# Altium schematic sheet Out_current_sensor_UVW.SchDoc
size 508 x 508 mm
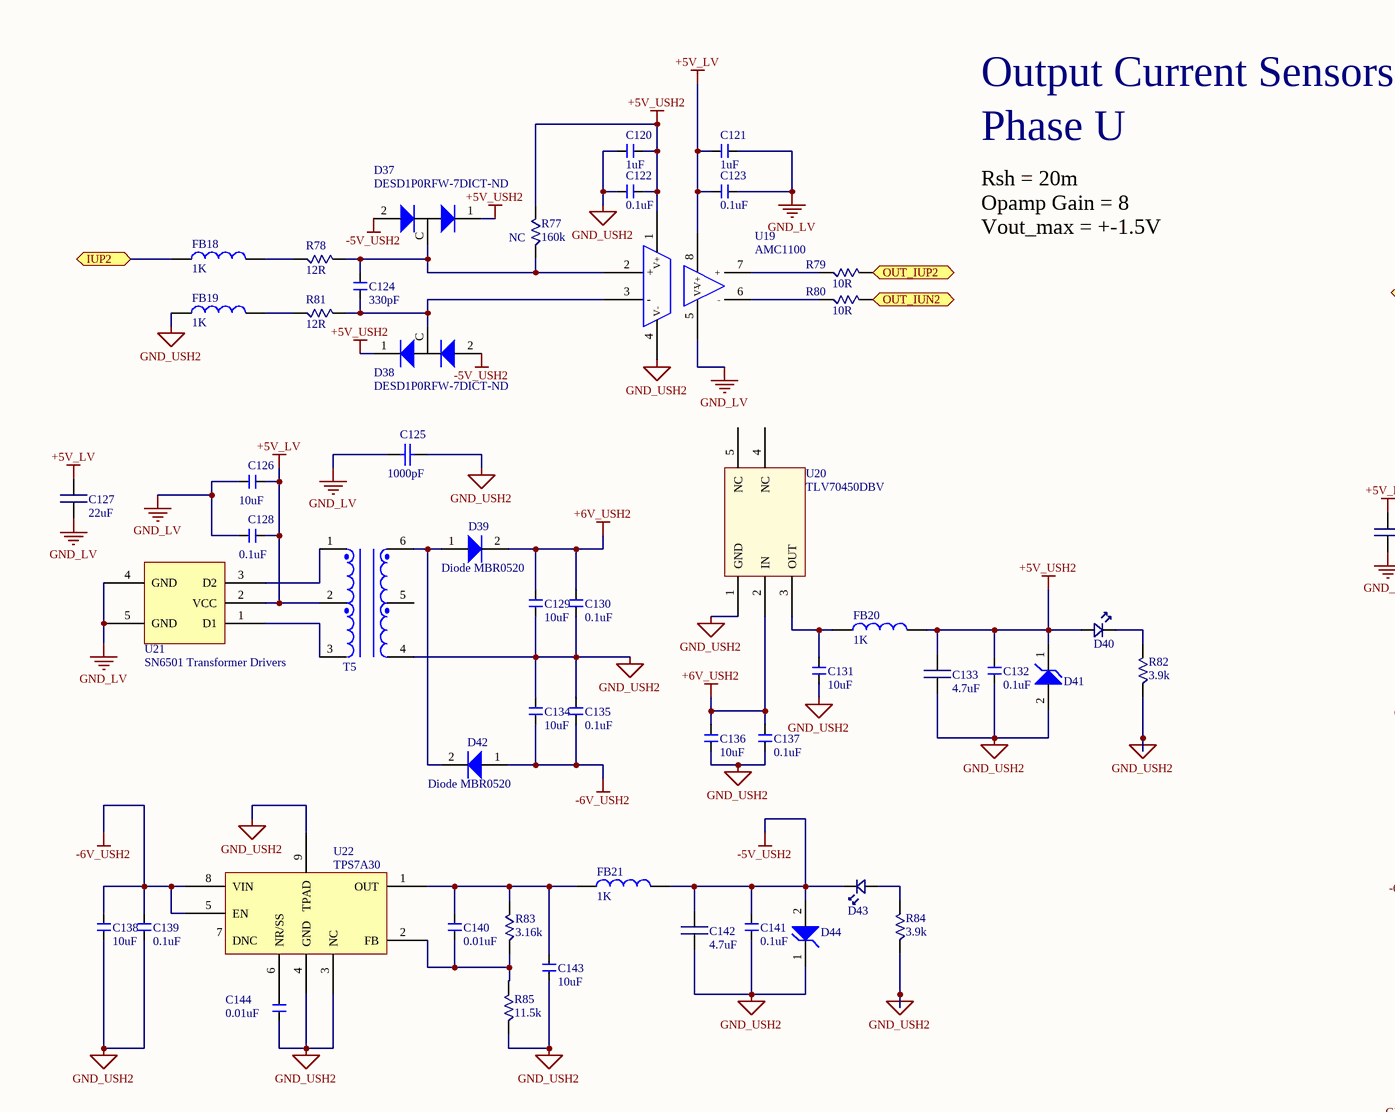
[diagram p0: Out_current_sensor_UVW.SchDoc, top left]
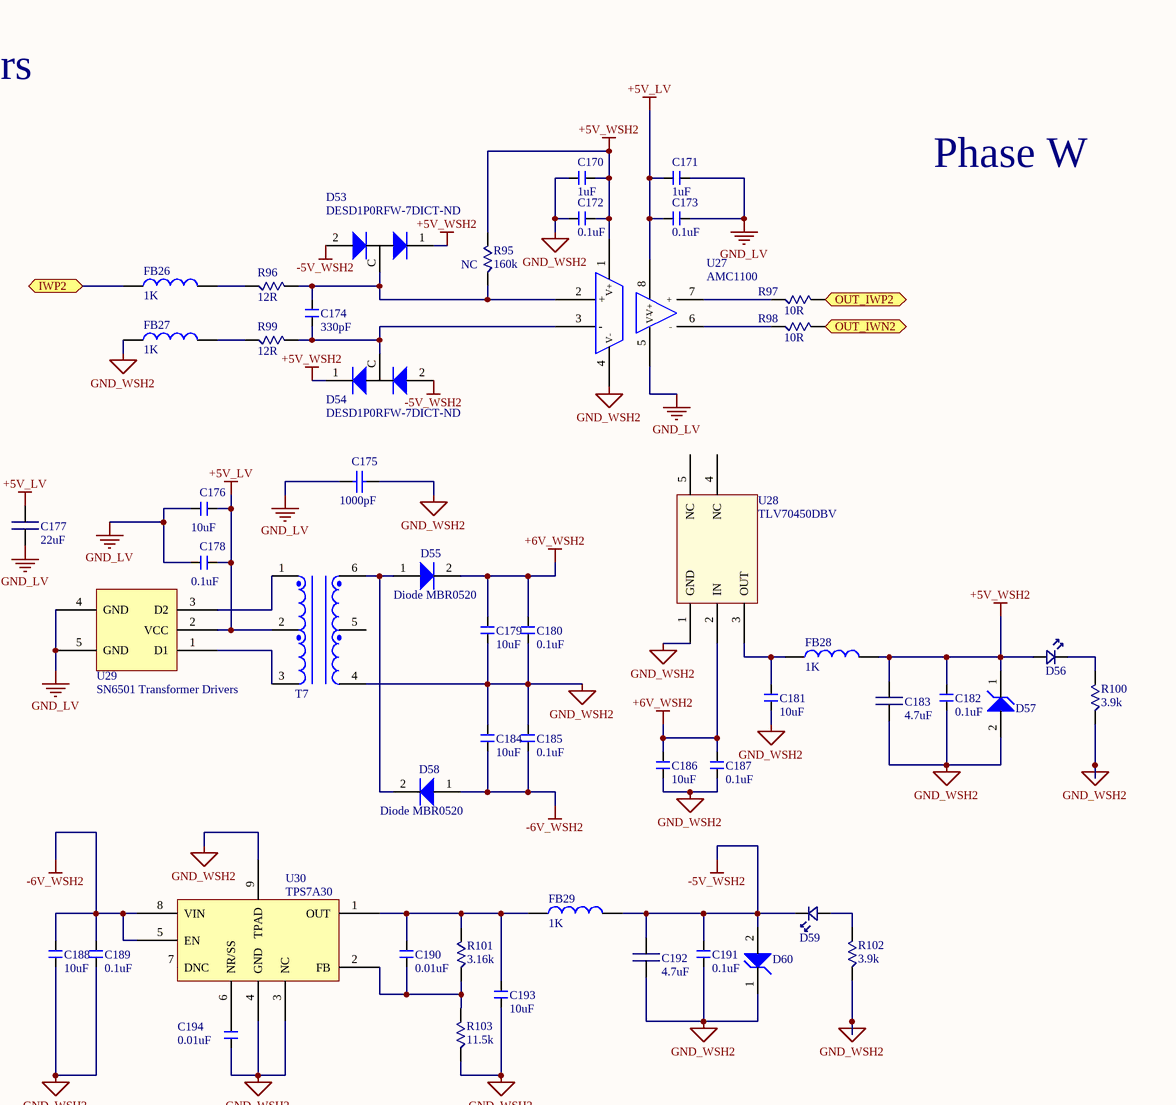
[diagram p1: Out_current_sensor_UVW.SchDoc, top right]
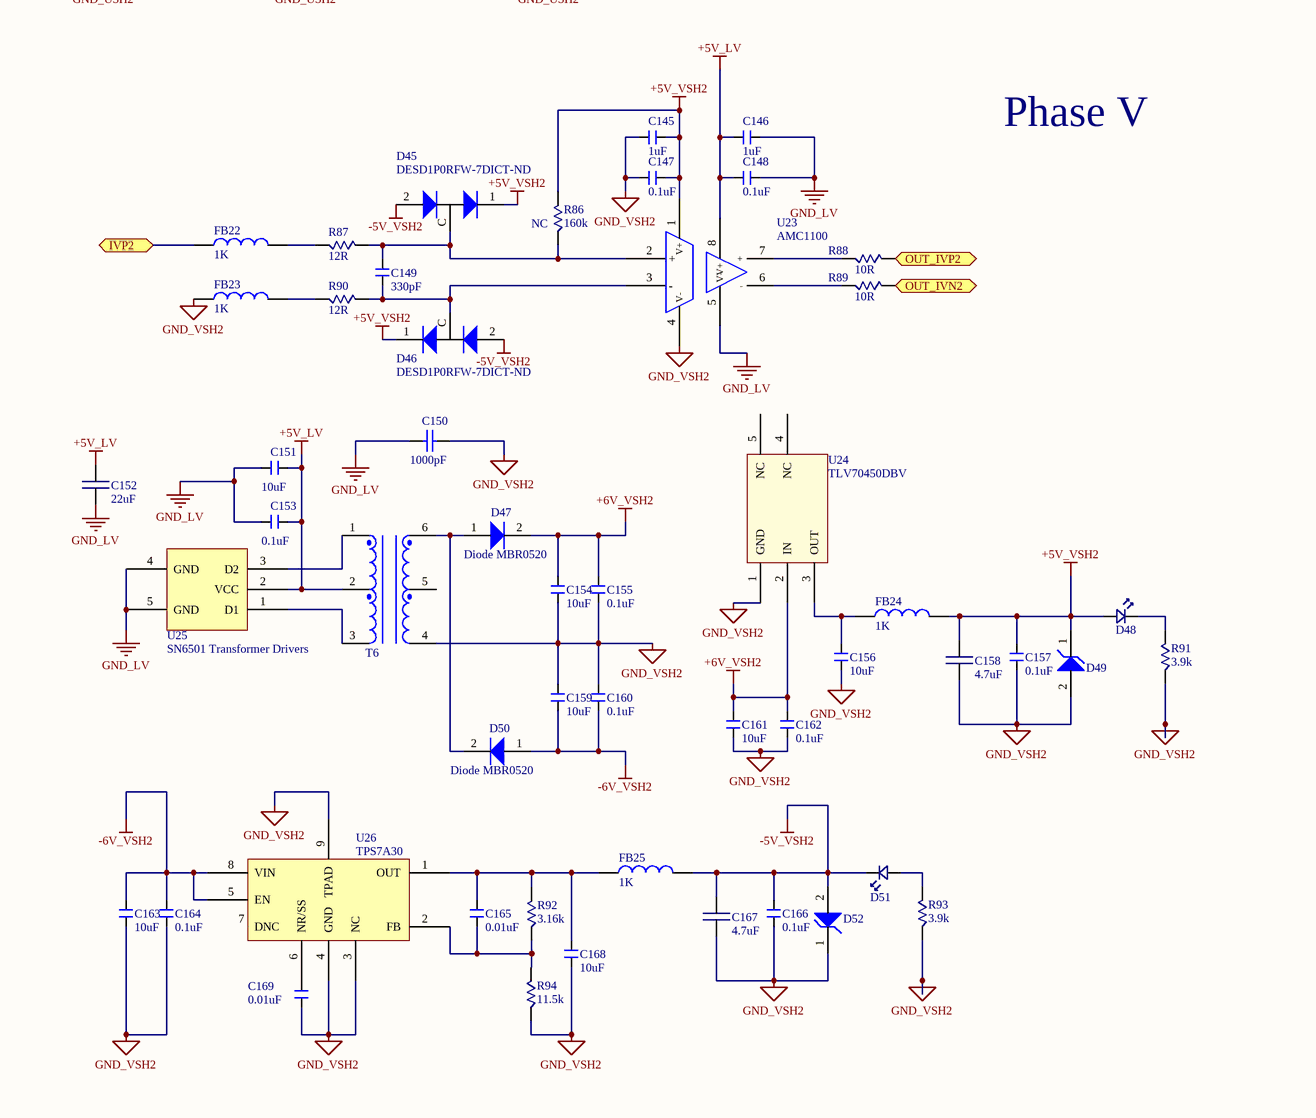
[diagram p2: Out_current_sensor_UVW.SchDoc, bottom left]

## Parts
C120  value 1uF  [0603 (1608 Metric)]  (hidden comment: Cap 0603_new)
C121  value 1uF  [0603 (1608 Metric)]  (hidden comment: Cap 0603_new)
C122  value 0.1uF  [0603 (1608 Metric)]  (hidden comment: Cap 0603_new)
C123  value 0.1uF  [0603 (1608 Metric)]  (hidden comment: Cap 0603_new)
C124  value 330pF  [0603 (1608 Metric)]  (hidden comment: Cap 0603_new)
C125  value 1000pF  [RAD-0.3]  (hidden comment: Cap TH)
C126  value 10uF  [0603 (1608 Metric)]  (hidden comment: Cap 0603_new)
C127  value 22uF  [0805 (2012 metric)]  (hidden comment: Cap 0805)
C128  value 0.1uF  [0603 (1608 Metric)]  (hidden comment: Cap 0603_new)
C129  value 10uF  [0603 (1608 Metric)]  (hidden comment: Cap 0603_new)
C130  value 0.1uF  [0603 (1608 Metric)]  (hidden comment: Cap 0603_new)
C131  value 10uF  [0603 (1608 Metric)]  (hidden comment: Cap 0603_new)
C132  value 0.1uF  [0603 (1608 Metric)]  (hidden comment: Cap 0603_new)
C133  value 4.7uF  [0805 (2012 metric)]  (hidden comment: Cap 0805)
C134  value 10uF  [0603 (1608 Metric)]  (hidden comment: Cap 0603_new)
C135  value 0.1uF  [0603 (1608 Metric)]  (hidden comment: Cap 0603_new)
C136  value 10uF  [0603 (1608 Metric)]  (hidden comment: Cap 0603_new)
C137  value 0.1uF  [0603 (1608 Metric)]  (hidden comment: Cap 0603_new)
C138  value 10uF  [0603 (1608 Metric)]  (hidden comment: Cap 0603_new)
C139  value 0.1uF  [0603 (1608 Metric)]  (hidden comment: Cap 0603_new)
C140  value 0.01uF  [0603 (1608 Metric)]  (hidden comment: Cap 0603_new)
C141  value 0.1uF  [0603 (1608 Metric)]  (hidden comment: Cap 0603_new)
C142  value 4.7uF  [0805 (2012 metric)]  (hidden comment: Cap 0805)
C143  value 10uF  [0603 (1608 Metric)]  (hidden comment: Cap 0603_new)
C144  value 0.01uF  [0603 (1608 Metric)]  (hidden comment: Cap 0603_new)
C145  value 1uF  [0603 (1608 Metric)]  (hidden comment: Cap 0603_new)
C146  value 1uF  [0603 (1608 Metric)]  (hidden comment: Cap 0603_new)
C147  value 0.1uF  [0603 (1608 Metric)]  (hidden comment: Cap 0603_new)
C148  value 0.1uF  [0603 (1608 Metric)]  (hidden comment: Cap 0603_new)
C149  value 330pF  [0603 (1608 Metric)]  (hidden comment: Cap 0603_new)
C150  value 1000pF  [RAD-0.3]  (hidden comment: Cap TH)
C151  value 10uF  [0603 (1608 Metric)]  (hidden comment: Cap 0603_new)
C152  value 22uF  [0805 (2012 metric)]  (hidden comment: Cap 0805)
C153  value 0.1uF  [0603 (1608 Metric)]  (hidden comment: Cap 0603_new)
C154  value 10uF  [0603 (1608 Metric)]  (hidden comment: Cap 0603_new)
C155  value 0.1uF  [0603 (1608 Metric)]  (hidden comment: Cap 0603_new)
C156  value 10uF  [0603 (1608 Metric)]  (hidden comment: Cap 0603_new)
C157  value 0.1uF  [0603 (1608 Metric)]  (hidden comment: Cap 0603_new)
C158  value 4.7uF  [0805 (2012 metric)]  (hidden comment: Cap 0805)
C159  value 10uF  [0603 (1608 Metric)]  (hidden comment: Cap 0603_new)
C160  value 0.1uF  [0603 (1608 Metric)]  (hidden comment: Cap 0603_new)
C161  value 10uF  [0603 (1608 Metric)]  (hidden comment: Cap 0603_new)
C162  value 0.1uF  [0603 (1608 Metric)]  (hidden comment: Cap 0603_new)
C163  value 10uF  [0603 (1608 Metric)]  (hidden comment: Cap 0603_new)
C164  value 0.1uF  [0603 (1608 Metric)]  (hidden comment: Cap 0603_new)
C165  value 0.01uF  [0603 (1608 Metric)]  (hidden comment: Cap 0603_new)
C166  value 0.1uF  [0603 (1608 Metric)]  (hidden comment: Cap 0603_new)
C167  value 4.7uF  [0805 (2012 metric)]  (hidden comment: Cap 0805)
C168  value 10uF  [0603 (1608 Metric)]  (hidden comment: Cap 0603_new)
C169  value 0.01uF  [0603 (1608 Metric)]  (hidden comment: Cap 0603_new)
C170  value 1uF  [0603 (1608 Metric)]  (hidden comment: Cap 0603_new)
C171  value 1uF  [0603 (1608 Metric)]  (hidden comment: Cap 0603_new)
C172  value 0.1uF  [0603 (1608 Metric)]  (hidden comment: Cap 0603_new)
C173  value 0.1uF  [0603 (1608 Metric)]  (hidden comment: Cap 0603_new)
C174  value 330pF  [0603 (1608 Metric)]  (hidden comment: Cap 0603_new)
C175  value 1000pF  [RAD-0.3]  (hidden comment: Cap TH)
C176  value 10uF  [0603 (1608 Metric)]  (hidden comment: Cap 0603_new)
C177  value 22uF  [0805 (2012 metric)]  (hidden comment: Cap 0805)
C178  value 0.1uF  [0603 (1608 Metric)]  (hidden comment: Cap 0603_new)
C179  value 10uF  [0603 (1608 Metric)]  (hidden comment: Cap 0603_new)
C180  value 0.1uF  [0603 (1608 Metric)]  (hidden comment: Cap 0603_new)
C181  value 10uF  [0603 (1608 Metric)]  (hidden comment: Cap 0603_new)
C182  value 0.1uF  [0603 (1608 Metric)]  (hidden comment: Cap 0603_new)
C183  value 4.7uF  [0805 (2012 metric)]  (hidden comment: Cap 0805)
C184  value 10uF  [0603 (1608 Metric)]  (hidden comment: Cap 0603_new)
C185  value 0.1uF  [0603 (1608 Metric)]  (hidden comment: Cap 0603_new)
C186  value 10uF  [0603 (1608 Metric)]  (hidden comment: Cap 0603_new)
C187  value 0.1uF  [0603 (1608 Metric)]  (hidden comment: Cap 0603_new)
C188  value 10uF  [0603 (1608 Metric)]  (hidden comment: Cap 0603_new)
C189  value 0.1uF  [0603 (1608 Metric)]  (hidden comment: Cap 0603_new)
C190  value 0.01uF  [0603 (1608 Metric)]  (hidden comment: Cap 0603_new)
C191  value 0.1uF  [0603 (1608 Metric)]  (hidden comment: Cap 0603_new)
C192  value 4.7uF  [0805 (2012 metric)]  (hidden comment: Cap 0805)
C193  value 10uF  [0603 (1608 Metric)]  (hidden comment: Cap 0603_new)
C194  value 0.01uF  [0603 (1608 Metric)]  (hidden comment: Cap 0603_new)
D37  Part: DESD1P0RFW-7DICT-ND  [SOT323_ESD]  (hidden comment: TVS - Diodes)
D38  Part: DESD1P0RFW-7DICT-ND  [SOT323_ESD]  (hidden comment: TVS - Diodes)
D39  Diode MBR0520  [SOD-123]
D40  LED  [0805 (2012 Metric) Diode]  (value not drawn)
D41  *  [POWERDI]  (value not drawn)
D42  Diode MBR0520  [SOD-123]
D43  LED  [0805 (2012 Metric) Diode]  (value not drawn)
D44  *  [POWERDI]  (value not drawn)
D45  Part: DESD1P0RFW-7DICT-ND  [SOT323_ESD]  (hidden comment: TVS - Diodes)
D46  Part: DESD1P0RFW-7DICT-ND  [SOT323_ESD]  (hidden comment: TVS - Diodes)
D47  Diode MBR0520  [SOD-123]
D48  LED  [0805 (2012 Metric) Diode]  (value not drawn)
D49  *  [POWERDI]  (value not drawn)
D50  Diode MBR0520  [SOD-123]
D51  LED  [0805 (2012 Metric) Diode]  (value not drawn)
D52  *  [POWERDI]  (value not drawn)
D53  Part: DESD1P0RFW-7DICT-ND  [SOT323_ESD]  (hidden comment: TVS - Diodes)
D54  Part: DESD1P0RFW-7DICT-ND  [SOT323_ESD]  (hidden comment: TVS - Diodes)
D55  Diode MBR0520  [SOD-123]
D56  LED  [0805 (2012 Metric) Diode]  (value not drawn)
D57  *  [POWERDI]  (value not drawn)
D58  Diode MBR0520  [SOD-123]
D59  LED  [0805 (2012 Metric) Diode]  (value not drawn)
D60  *  [POWERDI]  (value not drawn)
FB18  value 1K  [0603 (1608 Metric)]  (hidden comment: Ferrite bead)
FB19  value 1K  [0603 (1608 Metric)]  (hidden comment: Ferrite bead)
FB20  value 1K  [0603 (1608 Metric)]  (hidden comment: Ferrite bead)
FB21  value 1K  [0603 (1608 Metric)]  (hidden comment: Ferrite bead)
FB22  value 1K  [0603 (1608 Metric)]  (hidden comment: Ferrite bead)
FB23  value 1K  [0603 (1608 Metric)]  (hidden comment: Ferrite bead)
FB24  value 1K  [0603 (1608 Metric)]  (hidden comment: Ferrite bead)
FB25  value 1K  [0603 (1608 Metric)]  (hidden comment: Ferrite bead)
FB26  value 1K  [0603 (1608 Metric)]  (hidden comment: Ferrite bead)
FB27  value 1K  [0603 (1608 Metric)]  (hidden comment: Ferrite bead)
FB28  value 1K  [0603 (1608 Metric)]  (hidden comment: Ferrite bead)
FB29  value 1K  [0603 (1608 Metric)]  (hidden comment: Ferrite bead)
R77  NC  value 160k  [0603 (1608 Metric)]
R78  value 12R  [1206]  (hidden comment: Resistor 1206)
R79  value 10R  [0603 (1608 Metric)]  (hidden comment: Resistor 0603)
R80  value 10R  [0603 (1608 Metric)]  (hidden comment: Resistor 0603)
R81  value 12R  [1206]  (hidden comment: Resistor 1206)
R82  value 3.9k  [0603 (1608 Metric)]  (hidden comment: Resistor 0603)
R83  value 3.16k  [0603 (1608 Metric)]  (hidden comment: Resistor 0603)
R84  value 3.9k  [0603 (1608 Metric)]  (hidden comment: Resistor 0603)
R85  value 11.5k  [0603 (1608 Metric)]  (hidden comment: Resistor 0603)
R86  NC  value 160k  [0603 (1608 Metric)]
R87  value 12R  [1206]  (hidden comment: Resistor 1206)
R88  value 10R  [0603 (1608 Metric)]  (hidden comment: Resistor 0603)
R89  value 10R  [0603 (1608 Metric)]  (hidden comment: Resistor 0603)
R90  value 12R  [1206]  (hidden comment: Resistor 1206)
R91  value 3.9k  [0603 (1608 Metric)]  (hidden comment: Resistor 0603)
R92  value 3.16k  [0603 (1608 Metric)]  (hidden comment: Resistor 0603)
R93  value 3.9k  [0603 (1608 Metric)]  (hidden comment: Resistor 0603)
R94  value 11.5k  [0603 (1608 Metric)]  (hidden comment: Resistor 0603)
R95  NC  value 160k  [0603 (1608 Metric)]
R96  value 12R  [1206]  (hidden comment: Resistor 1206)
R97  value 10R  [0603 (1608 Metric)]  (hidden comment: Resistor 0603)
R98  value 10R  [0603 (1608 Metric)]  (hidden comment: Resistor 0603)
R99  value 12R  [1206]  (hidden comment: Resistor 1206)
R100  value 3.9k  [0603 (1608 Metric)]  (hidden comment: Resistor 0603)
R101  value 3.16k  [0603 (1608 Metric)]  (hidden comment: Resistor 0603)
R102  value 3.9k  [0603 (1608 Metric)]  (hidden comment: Resistor 0603)
R103  value 11.5k  [0603 (1608 Metric)]  (hidden comment: Resistor 0603)
T5  750313769  [Xmr SN6501]  (value not drawn)
T6  750313769  [Xmr SN6501]  (value not drawn)
T7  750313769  [Xmr SN6501]  (value not drawn)
U19  AMC1100  [SOIC8]
U20  TLV70450DBV  [SOT23-5]
U21  SN6501 Transformer Drivers  [SOT23-5]
U22  TPS7A30  [8-TSSOP]
U23  AMC1100  [SOIC8]
U24  TLV70450DBV  [SOT23-5]
U25  SN6501 Transformer Drivers  [SOT23-5]
U26  TPS7A30  [8-TSSOP]
U27  AMC1100  [SOIC8]
U28  TLV70450DBV  [SOT23-5]
U29  SN6501 Transformer Drivers  [SOT23-5]
U30  TPS7A30  [8-TSSOP]

## Ports
IUP2, IVP2, IWP2, OUT_IUN2, OUT_IUP2, OUT_IVN2, OUT_IVP2, OUT_IWN2, OUT_IWP2

## Nets
+5V_LV: C121.1(OUT) C123.1(OUT) C126.2(OUT) C127.2(OUT) C128.2(OUT) C146.1(OUT) C148.1(OUT) C151.2(OUT) C152.2(OUT) C153.2(OUT) C171.1(OUT) C173.1(OUT) C176.2(OUT) C177.2(OUT) C178.2(OUT) T5.2 T6.2 T7.2 U19.8(V+) U21.2(VCC) U23.8(V+) U25.2(VCC) U27.8(V+) U29.2(VCC)
+5V_USH2: C120.2(OUT) C122.2(OUT) C132.2(OUT) C133.2(OUT) D37.1(Anode) D38.1(Anode) D40.A D41.1(Anode) FB20.2(OUT) R77.2(A) U19.1(V+)
+5V_VSH2: C145.2(OUT) C147.2(OUT) C157.2(OUT) C158.2(OUT) D45.1(Anode) D46.1(Anode) D48.A D49.1(Anode) FB24.2(OUT) R86.2(A) U23.1(V+)
+5V_WSH2: C170.2(OUT) C172.2(OUT) C182.2(OUT) C183.2(OUT) D53.1(Anode) D54.1(Anode) D56.A D57.1(Anode) FB28.2(OUT) R95.2(A) U27.1(V+)
+6V_USH2: C129.2(OUT) C130.2(OUT) C136.2(OUT) C137.2(OUT) D39.2(Anode) U20.2(IN)
+6V_VSH2: C154.2(OUT) C155.2(OUT) C161.2(OUT) C162.2(OUT) D47.2(Anode) U24.2(IN)
+6V_WSH2: C179.2(OUT) C180.2(OUT) C186.2(OUT) C187.2(OUT) D55.2(Anode) U28.2(IN)
-5V_USH2: C141.2(OUT) C142.2(OUT) D37.2(Anode) D38.2(Anode) D43.K D44.2(Anode) FB21.2(OUT)
-5V_VSH2: C166.2(OUT) C167.2(OUT) D45.2(Anode) D46.2(Anode) D51.K D52.2(Anode) FB25.2(OUT)
-5V_WSH2: C191.2(OUT) C192.2(OUT) D53.2(Anode) D54.2(Anode) D59.K D60.2(Anode) FB29.2(OUT)
-6V_USH2: C134.1(OUT) C135.1(OUT) C138.2(OUT) C139.2(OUT) D42.1(Anode) U22.5(EN) U22.8(VIN)
-6V_VSH2: C159.1(OUT) C160.1(OUT) C163.2(OUT) C164.2(OUT) D50.1(Anode) U26.5(EN) U26.8(VIN)
-6V_WSH2: C184.1(OUT) C185.1(OUT) C188.2(OUT) C189.2(OUT) D58.1(Anode) U30.5(EN) U30.8(VIN)
GND_LV: C121.2(OUT) C123.2(OUT) C125.1 C126.1(OUT) C127.1(OUT) C128.1(OUT) C146.2(OUT) C148.2(OUT) C150.1 C151.1(OUT) C152.1(OUT) C153.1(OUT) C171.2(OUT) C173.2(OUT) C175.1 C176.1(OUT) C177.1(OUT) C178.1(OUT) U19.5(V-) U21.4(GND) U21.5(GND) U23.5(V-) U25.4(GND) U25.5(GND) U27.5(V-) U29.4(GND) U29.5(GND)
GND_USH2: C120.1(OUT) C122.1(OUT) C125.2 C129.1(OUT) C130.1(OUT) C131.1(OUT) C132.1(OUT) C133.1(OUT) C134.2(OUT) C135.2(OUT) C136.1(OUT) C137.1(OUT) C138.1(OUT) C139.1(OUT) C141.1(OUT) C142.1(OUT) C143.1(OUT) C144.1(OUT) D41.2(Anode) D44.1(Anode) FB19.1(OUT) R82.1(A) R84.1(A) R85.1(A) T5.4 U19.4(V-) U20.1(GND) U22.3(NC) U22.4(GND) U22.9(TPAD)
GND_VSH2: C145.1(OUT) C147.1(OUT) C150.2 C154.1(OUT) C155.1(OUT) C156.1(OUT) C157.1(OUT) C158.1(OUT) C159.2(OUT) C160.2(OUT) C161.1(OUT) C162.1(OUT) C163.1(OUT) C164.1(OUT) C166.1(OUT) C167.1(OUT) C168.1(OUT) C169.1(OUT) D49.2(Anode) D52.1(Anode) FB23.1(OUT) R91.1(A) R93.1(A) R94.1(A) T6.4 U23.4(V-) U24.1(GND) U26.3(NC) U26.4(GND) U26.9(TPAD)
GND_WSH2: C170.1(OUT) C172.1(OUT) C175.2 C179.1(OUT) C180.1(OUT) C181.1(OUT) C182.1(OUT) C183.1(OUT) C184.2(OUT) C185.2(OUT) C186.1(OUT) C187.1(OUT) C188.1(OUT) C189.1(OUT) C191.1(OUT) C192.1(OUT) C193.1(OUT) C194.1(OUT) D57.2(Anode) D60.1(Anode) FB27.1(OUT) R100.1(A) R102.1(A) R103.1(A) T7.4 U27.4(V-) U28.1(GND) U30.3(NC) U30.4(GND) U30.9(TPAD)
IUP2: FB18.1(OUT) ; port IUP2
IVP2: FB22.1(OUT) ; port IVP2
IWP2: FB26.1(OUT) ; port IWP2
OUT_IUN2: R80.2(A) ; port OUT_IUN2
OUT_IUP2: R79.2(A) ; port OUT_IUP2
OUT_IVN2: R89.2(A) ; port OUT_IVN2
OUT_IVP2: R88.2(A) ; port OUT_IVP2
OUT_IWN2: R98.2(A) ; port OUT_IWN2
OUT_IWP2: R97.2(A) ; port OUT_IWP2
NetC124_1: C124.1(OUT) D37.C(Cathode) R77.1(A) R78.2(A) U19.2(+)
NetC124_2: C124.2(OUT) D38.C(Cathode) R81.2(A) U19.3(-)
NetC131_2: C131.2(OUT) FB20.1(OUT) U20.3(OUT)
NetC140_1: C140.1(OUT) C143.2(OUT) FB21.1(OUT) R83.2(A) U22.1(OUT)
NetC140_2: C140.2(OUT) R83.1(A) R85.2(A) U22.2(FB)
NetC144_2: C144.2(OUT) U22.6(NR/SS)
NetC149_1: C149.1(OUT) D45.C(Cathode) R86.1(A) R87.2(A) U23.2(+)
NetC149_2: C149.2(OUT) D46.C(Cathode) R90.2(A) U23.3(-)
NetC156_2: C156.2(OUT) FB24.1(OUT) U24.3(OUT)
NetC165_1: C165.1(OUT) C168.2(OUT) FB25.1(OUT) R92.2(A) U26.1(OUT)
NetC165_2: C165.2(OUT) R92.1(A) R94.2(A) U26.2(FB)
NetC169_2: C169.2(OUT) U26.6(NR/SS)
NetC174_1: C174.1(OUT) D53.C(Cathode) R95.1(A) R96.2(A) U27.2(+)
NetC174_2: C174.2(OUT) D54.C(Cathode) R99.2(A) U27.3(-)
NetC181_2: C181.2(OUT) FB28.1(OUT) U28.3(OUT)
NetC190_1: C190.1(OUT) C193.2(OUT) FB29.1(OUT) R101.2(A) U30.1(OUT)
NetC190_2: C190.2(OUT) R101.1(A) R103.2(A) U30.2(FB)
NetC194_2: C194.2(OUT) U30.6(NR/SS)
NetD39_1: D39.1(Anode) D42.2(Anode) T5.6
NetD40_K: D40.K R82.2(A)
NetD43_A: D43.A R84.2(A)
NetD47_1: D47.1(Anode) D50.2(Anode) T6.6
NetD48_K: D48.K R91.2(A)
NetD51_A: D51.A R93.2(A)
NetD55_1: D55.1(Anode) D58.2(Anode) T7.6
NetD56_K: D56.K R100.2(A)
NetD59_A: D59.A R102.2(A)
NetFB18_2: FB18.2(OUT) R78.1(A)
NetFB19_2: FB19.2(OUT) R81.1(A)
NetFB22_2: FB22.2(OUT) R87.1(A)
NetFB23_2: FB23.2(OUT) R90.1(A)
NetFB26_2: FB26.2(OUT) R96.1(A)
NetFB27_2: FB27.2(OUT) R99.1(A)
NetR79_1: R79.1(A) U19.7(+)
NetR80_1: R80.1(A) U19.6(-)
NetR88_1: R88.1(A) U23.7(+)
NetR89_1: R89.1(A) U23.6(-)
NetR97_1: R97.1(A) U27.7(+)
NetR98_1: R98.1(A) U27.6(-)
NetT5_1: T5.1 U21.3(D2)
NetT5_3: T5.3 U21.1(D1)
NetT6_1: T6.1 U25.3(D2)
NetT6_3: T6.3 U25.1(D1)
NetT7_1: T7.1 U29.3(D2)
NetT7_3: T7.3 U29.1(D1)

Not connected (* = marked no-connect by the designer): T5 5(1); T6 5(1); T7 5(1); U20 4(NC) 5(NC); U22 7(DNC); U24 4(NC) 5(NC); U26 7(DNC); U28 4(NC) 5(NC); U30 7(DNC)

## Notes on the sheet
- Output Current Sensors
- Phase U
- Phase W
- Rsh = 20m
  Opamp Gain = 8
  Vout_max = +-1.5V
  Maximum current = +- 9.375A
- Phase V

## Library data of the parts
C120 C121 C145 C146 C170 C171 = Cap 0603_new: CAP CER 1UF 50V X5R 0603; part: 1276-1860-1-ND
C122 C123 C128 C130 C132 C135 C137 C139 C141 C147 C148 C153 C155 C157 C160 C162 C164 C166 C172 C173 C178 C180 C182 C185 C187 C189 C191 = Cap 0603_new: CAP CER 0.1UF 50V Y5V 0603; part: 311-1343-6-ND
C124 C149 C174 = Cap 0603_new: CAP CER 330PF 50V C0G 0603; part: 445-7033-2-ND
C125 C150 C175 = Cap: CAP CER 1000PF 1KV Y5P RADIAL; Part: 1251PH-ND; Published: 8-Jun-2000; LatestRevisionDate: 17-Jul-2002; LatestRevisionNote: Re-released for DXP Platform.; PackageReference: RAD-0.3; Publisher: Altium Limited; PackageDescription: Radial Cap, Thru-Hole; 2 Leads; 0.3 in Pin Spacing
C126 C129 C131 C134 C136 C138 C143 C151 C154 C156 C159 C161 C163 C168 C176 C179 C181 C184 C186 C188 C193 = Cap 0603_new: CAP CER 10UF 35V X5R 0805; part: 490-10515-1-ND
C127 C152 C177 = Cap 0805: CAP CER 22UF 35V X5R 0805; Part: 445-14428-1-ND
C133 C142 C158 C167 C183 C192 = Cap 0805: CAP CER 4.7UF 50V X5R 0805; Part: 445-5980-1-ND
C140 C144 C165 C169 C190 C194 = Cap 0603_new: CAP CER 10000PF 100V X7R 0603; part: 478-7418-1-ND
D37 D38 D45 D46 D53 D54 = Diode_ESD: TVS DIODE 70VWM 8VC SOT323; Value: ESD
D39 D42 D47 D50 D55 D58 = Diode MBR0520: DIODE SCHOTTKY 20V 500MA SOD123; Part: MBR0520LT1GOSCT-ND; Value: *
D40 D43 D48 D51 D56 D59 = LED: LED 0805
D41 D44 D49 D52 D57 D60 = Diode Zener POWERDI123: Part: MMSZ5228B-FDICT-ND; Value: *
FB18-FB29 = Ferrite bead: FERRITE BEAD 1 KOHM 0603 1LN; Part: 445-8672-1-ND
R77 R86 R95 = Resistor 0603
R78 R81 R87 R90 R96 R99 = Resistor 1206: 12 Ohm ±0.5% 0.25W, 1/4W Chip Resistor 1206; Part: 311-2961-1-ND
R79 R80 R88 R89 R97 R98 = Resistor 0603: RES SMD 10 OHM 0.05% 1/10W 0603; Part: RNCF0603AKT10R0CT-ND
R82 R84 R91 R93 R100 R102 = Resistor 0603: RES SMD 3.9K OHM 5% 1/10W 0603; Part: 541-3.9KGCT-ND
R83 R92 R101 = Resistor 0603: RES SMD 3.16K OHM 1% 1/10W 0603; Part: 311-3.16KHRCT-ND
R85 R94 R103 = Resistor 0603: RES SMD 11.5K OHM 1% 1/10W 0603; Part: 541-11.5KHCT-ND
T5-T7 = 750313769: TRANSFORMER SMD TR1.7 SN6501; Part: 1297-1107-1-ND
U19 U23 U27 = AMC1100: IC OPAMP ISOLATION 100KHZ 8SOIC; Part: 296-38822-5-ND
U20 U24 U28 = TLV70450DBV: IC REG LDO 5V 0.15A SOT23-5; Part: 296-39287-1-ND
U21 U25 U29 = SN6501: IC REG CONV PWR SUPPLIES SOT23-5; Part: 296-37700-1-ND; Value: *
U22 U26 U30 = TPS7A30: IC REG LDO NEG ADJ 0.2A 8MSOP; Part: 296-27750-1-ND